# Altium schematic sheet SCC.SchDoc: RcMPPT-Power_Module
size A4; Author: Thomas Hofmann; DocumentNumber: 1; Revision: 1.0; SheetNumber: 1; SheetTotal: 1
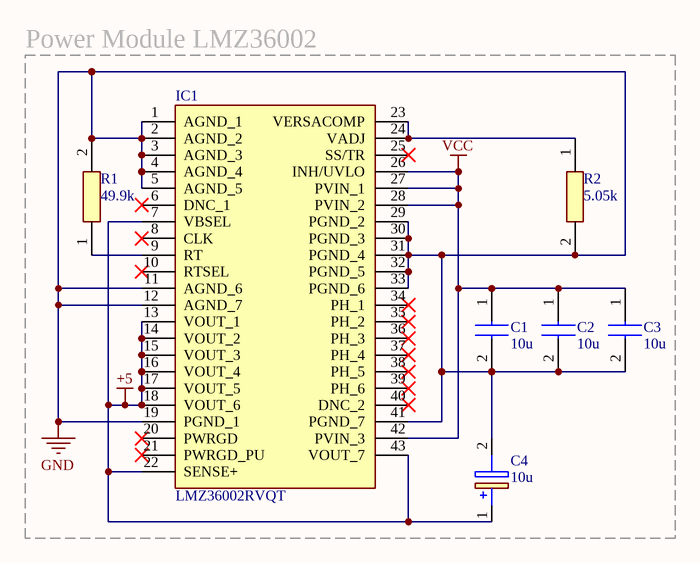
[diagram p0: SCC.SchDoc]

## Parts
C1  10u  [CAPC3225X280N]
C2  10u  [CAPC3225X280N]
C3  10u  [CAPC3225X280N]
C4  10u  [CAPPM3528X210N]
IC1  LMZ36002RVQT  [LMZ36002RVQR]
R1  49.9k  [R0805]
R2  5.05k  [R0805]

## Blocks framed on the sheet
Power Module LMZ36002: C1-C4 IC1 R1 R2

## Nets
+5: C4.1(+) IC1.7(VBSEL) IC1.13(VOUT_1) IC1.14(VOUT_2) IC1.15(VOUT_3) IC1.16(VOUT_4) IC1.17(VOUT_5) IC1.18(VOUT_6) IC1.22(SENSE+) IC1.43(VOUT_7)
GND: C1.2 C2.2 C3.2 C4.2(-) IC1.1(AGND_1) IC1.2(AGND_2) IC1.3(AGND_3) IC1.4(AGND_4) IC1.5(AGND_5) IC1.11(AGND_6) IC1.12(AGND_7) IC1.19(PGND_1) IC1.29(PGND_2) IC1.30(PGND_3) IC1.31(PGND_4) IC1.32(PGND_5) IC1.33(PGND_6) IC1.41(PGND_7) R1.2 R2.2
VCC: C1.1 C2.1 C3.1 IC1.26(INH/UVLO) IC1.27(PVIN_1) IC1.28(PVIN_2) IC1.42(PVIN_3)
NetIC1_9: IC1.9(RT) R1.1
NetIC1_23: IC1.23(VERSACOMP) IC1.24(VADJ) R2.1

Not connected (* = marked no-connect by the designer): IC1 6(DNC_1)* 8(CLK)* 10(RTSEL)* 20(PWRGD)* 21(PWRGD_PU)* 25(SS/TR)* 34(PH_1)* 35(PH_2)* 36(PH_3)* 37(PH_4)* 38(PH_5)* 39(PH_6)* 40(DNC_2)*

## Notes on the sheet
- Title
- Size:
- Date:
- A4
- Number:
- Time:
- Revision:
- Sheet
- of
- File:

## Library data of the parts
C1-C3 = CL32B106KMVNNWE: Capacitor; Manufacturer_Name: Samsung Electro-Mechanics; Datasheet Link: https://www.arrow.com/en/products/cl32b106kmvnnwe/samsung-electro-mechanics; Height: 2.8mm; Manufacturer_Part_Number: CL32B106KMVNNWE; Arrow Part Number: CL32B106KMVNNWE; Arrow Price/Stock: https://www.arrow.com/en/products/cl32b106kmvnnwe/samsung-electro-mechanics; Mouser Part Number: N/A; Mouser Price/Stock: https://www.mouser.co.uk/ProductDetail/Samsung-Electro-Mechanics/CL32B106KMVNNWE?qs=xZ%2FP%252Ba9zWqaEMBbSgKy8gQ%3D%3D
C4 = TCJB106M025R0100: Capacitor Polarised; Manufacturer_Name: AVX; Datasheet Link: http://datasheets.avx.com/TCJ.pdf; Height: 2.1mm; Manufacturer_Part_Number: TCJB106M025R0100; Mouser Part Number: 581-TCJB106M025R; Mouser Price/Stock: https://www.mouser.com/Search/Refine.aspx?Keyword=581-TCJB106M025R
IC1 = LMZ36002RVQT: Integrated Circuit; Manufacturer_Name: Texas Instruments; Datasheet Link: http://www.ti.com/lit/gpn/lmz36002; Height: 2.13mm; Manufacturer_Part_Number: LMZ36002RVQT; Arrow Part Number: LMZ36002RVQT; Arrow Price/Stock: https://www.arrow.com/en/products/lmz36002rvqt/texas-instruments; Mouser Part Number: 595-LMZ36002RVQT; Mouser Price/Stock: https://www.mouser.co.uk/ProductDetail/Texas-Instruments/LMZ36002RVQT?qs=kFLL9AfgRSBjXTxBMSjGOw%3D%3D
R1 = ERJ-6ENF4992V: Resistor; Manufacturer_Name: Panasonic; Datasheet Link: https://industrial.panasonic.com/cdbs/www-data/pdf/RDA0000/AOA0000C84.pdf; Height: 0.7mm; Manufacturer_Part_Number: ERJ-6ENF4992V; Mouser Part Number: 667-ERJ-6ENF4992V; Mouser Price/Stock: https://www.mouser.com/Search/Refine.aspx?Keyword=667-ERJ-6ENF4992V
R2 = RT0805BRD075K05L: Resistor; Manufacturer_Name: Yageo; Datasheet Link: https://www.mouser.at/datasheet/2/447/PYu-RT_1-to-0.01_RoHS_L_11-1669912.pdf; Height: 0.7mm; Manufacturer_Part_Number: RT0805BRD075K05L; Mouser Part Number: 603-RT0805BRD075K05L; Mouser Price/Stock: https://www.mouser.at/ProductDetail/Yageo/RT0805BRD075K05L?qs=bQfrgN9vNvwObDVrZ%2FDM5w%3D%3D